# EAGLE design Akuaphonic_All_FIX (EAGLE 7.2.0)
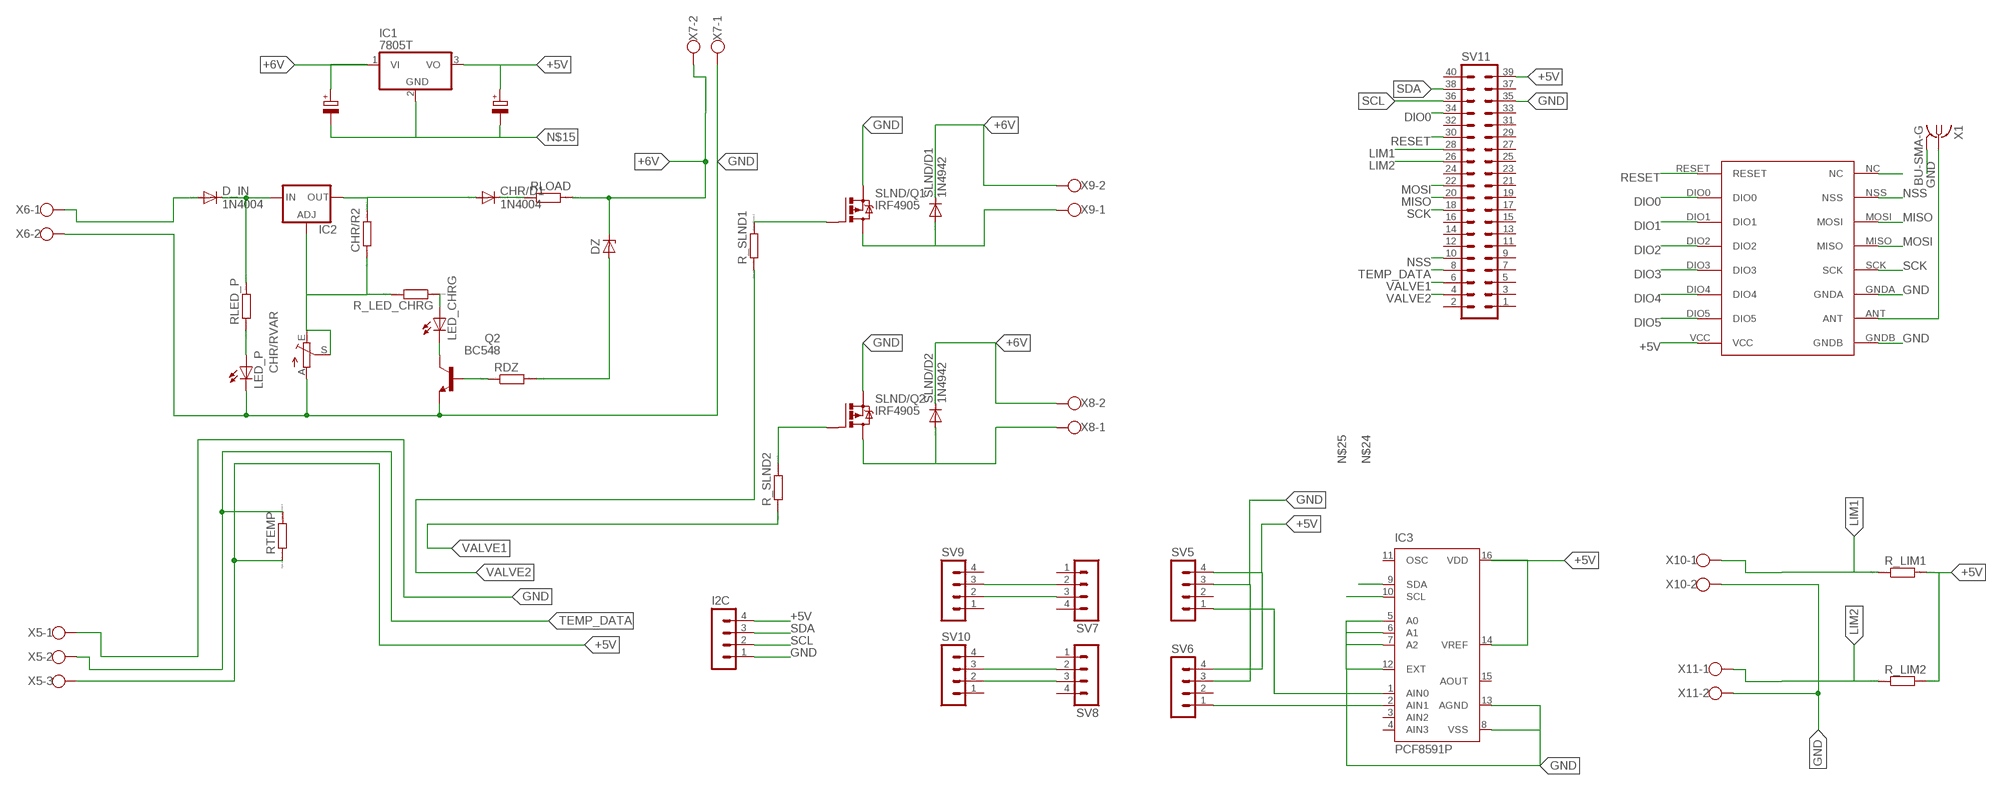
[diagram p0: schematic, sheet 1]

## Parts
CHR/D1  1N4004  [DO41-10]
CHR/R2  R0207/10  [0207/10]
CHR/RVAR  TRIM_EU-B25P  [B25P]
D_IN  1N4004  [DO41-10]
DZ  ZENER-DIODEDO35Z10  [DO35Z10]
I2C  MA04-1  [MA04-1]
IC1  7805T  [TO220H]
IC2  LM317TL  [317TL]
IC3  PCF8591P  [DIL16]
LED_CHRG  LED3MM  [LED3MM]
LED_P  LED3MM  [LED3MM]
Q2  BC548  [TO92-EBC]
R_LED_CHRG  R0207/10  [0207/10]
R_LIM1  R0207/10  [0207/10]
R_LIM2  R0207/10  [0207/10]
R_SLND1  R0207/10  [0207/10]
R_SLND2  R0207/10  [0207/10]
RDZ  R0207/10  [0207/10]
RLED_P  R0207/10  [0207/10]
RLOAD  R0207/10  [0207/10]
RTEMP  R0207/10  [0207/10]
SLND/D1  1N4942  [DO41-10]
SLND/D2  1N4942  [DO41-10]
SLND/Q1  IRF4905  [TO220BH]
SLND/Q2  IRF4905  [TO220BH]
SV5  MA04-1  [MA04-1]
SV6  MA04-1  [MA04-1]
SV7  MA04-1  [MA04-1]
SV8  MA04-1  [MA04-1]
SV9  MA04-1  [MA04-1]
SV10  MA04-1  [MA04-1]
SV11  MA20-2  [MA20-2]
U$1  RFM69HW  [RFM]
X1  BU-SMA-G  [BU-SMA-G]
X5  W237-103  [W237-103]
X6  W237-102  [W237-102]
X7  W237-102  [W237-102]
X8  W237-102  [W237-102]
X9  W237-102  [W237-102]
X10  W237-102  [W237-102]
X11  W237-102  [W237-102]

## Nets
+5V: I2C.4 IC1.3(VO) IC3.14(VREF) IC3.16(VDD) R_LIM1.2 R_LIM2.2 RTEMP.1 SV5.4 SV6.4 SV11.39 U$1.VCC X5.3
+6V: DZ.C IC1.1(VI) RLOAD.2 SLND/D1.C SLND/D2.C X7.2 X8.2 X9.2
DIO0: SV11.34 U$1.DIO0
DIO1: U$1.DIO1
DIO2: U$1.DIO2
DIO3: U$1.DIO3
DIO4: U$1.DIO4
DIO5: U$1.DIO5
DLOAD: CHR/D1.C RLOAD.1
GND: CHR/RVAR.A I2C.1 IC3.5(A0) IC3.6(A1) IC3.7(A2) IC3.8(VSS) IC3.12(EXT) IC3.13(AGND) LED_P.K(C) Q2.E SLND/Q1.S SLND/Q2.S SV5.3 SV6.3 SV11.35 U$1.GNDA U$1.GNDB X1.2 X1.3 X1.4 X1.5 X5.1 X6.2 X7.1 X10.2 X11.2
LIM1: R_LIM1.1 SV11.28 X10.1
LIM2: R_LIM2.1 SV11.26 X11.1
LM143: CHR/R2.1 CHR/RVAR.E CHR/RVAR.S IC2.1(ADJ) R_LED_CHRG.2
MISO: SV11.20 U$1.MOSI
MOSI: SV11.22 U$1.MISO
N$1: D_IN.A X6.1
N$2: LED_CHRG.K(C) Q2.C
N$3: U$1.ANT X1.1
N$4: D_IN.C IC2.3(IN) RLED_P.2
N$5: CHR/D1.A CHR/R2.2 IC2.2(OUT)
N$6: SLND/D1.A SLND/Q1.D X9.1
N$9: LED_P.A RLED_P.1
N$10: Q2.B RDZ.1
N$12: R_SLND1.2 SLND/Q1.G
N$13: LED_CHRG.A R_LED_CHRG.1
N$15: IC1.2(GND)
N$16: SLND/D2.A SLND/Q2.D X8.1
N$18: SV7.2 SV9.3
N$21: R_SLND2.2 SLND/Q2.G
N$22: SV7.3 SV9.2
N$23: DZ.A RDZ.2
N$24: IC3.9(SDA)
N$25: IC3.10(SCL)
N$27: U$1.NC
N$68: SV8.2 SV10.3
N$69: SV8.3 SV10.2
N$72: IC3.1(AIN0) SV5.1
N$73: IC3.2(AIN1) SV6.1
NSS: SV11.10 U$1.NSS
RESET: SV11.30 U$1.RESET
SCK: SV11.18 U$1.SCK
SCL: I2C.2 SV11.36
SDA: I2C.3 SV11.38
TEMP_DATA: RTEMP.2 SV11.8 X5.2
VALVE1: R_SLND2.1 SV11.6
VALVE2: R_SLND1.1 SV11.4
Unconnected: IC3.3(AIN2) IC3.4(AIN3) IC3.11(OSC) IC3.15(AOUT) SV5.2 SV6.2 SV7.1 SV7.4 SV8.1 SV8.4 SV9.1 SV9.4 SV10.1 SV10.4 SV11.1 SV11.2 SV11.3 SV11.5 SV11.7 SV11.9 SV11.11 SV11.12 SV11.13 SV11.14 SV11.15 SV11.16 SV11.17 SV11.19 SV11.21 SV11.23 SV11.24 SV11.25 SV11.27 SV11.29 SV11.31 SV11.32 SV11.33 SV11.37 SV11.40

## Library data of the parts
CHR/D1 D_IN = diode:1N4004: DIODE general purpose rectifier, 1 A
CHR/R2 R_LED_CHRG R_LIM1 R_LIM2 R_SLND1 R_SLND2 RDZ RLED_P RLOAD RTEMP = eagle-ltspice:R: RESISTOR, European symbol; SPICEMODEL: NONE; SPICEPREFIX: R
CHR/RVAR = pot:TRIM_EU-: POTENTIOMETER
DZ = diode:ZENER-DIODE: Z-Diode
I2C SV5-SV10 = con-lstb:MA04-1: PIN HEADER; OC_FARNELL: unknown; OC_NEWARK: unknown
IC1 = linear:78*: Positive VOLTAGE REGULATOR Source: http://cache.national.com/ds/LM/LM78L05.pdf http://www.fairchildsemi.com/ds/LM/LM7805.pdf
IC2 = v-reg:LM317TL: VOLTAGE REGULATOR
IC3 = micro-philips:PCF8591: I2C-Bus D/A CONVERTER; MF: FARNELL; MPN: PCF8591P; OC_FARNELL: 396412; OC_NEWARK: 07WX3385
LED_CHRG LED_P = led:LED: LED OSRAM: - CHIPLED LG R971, LG N971, LY N971, LG Q971, LY Q971, LO R971, LY R971 LH N974, LH R974 LS Q976, LO Q976, LY Q976 LO Q996 - Hyper CHIPLED LW Q18S LB Q993, LB Q99A, LB R99A - SideLED LS A670, LO A670, LY A670, LG A670, LP A670 LB A673, LV A673, LT A673, LW A673 LH A674 LY A675 LS A676, LA A676, LO A676, LY A676, LW A676 LS A679, LY A679, LG A679 - Hyper Micro SIDELED® LS Y876, LA Y876, LO Y876, LY Y876 LT Y87S - SmartLED LW L88C, LW L88S LB L89C, LB L89S, LG L890 LS L89K, LO L89K, LY L89K LS L896, LA L896, LO L896, LY L896 - TOPLED LS T670, LO T670, LY T670, LG T670, LP T670 LSG T670, LSP T670, LSY T670, LOP T670, LYG T670 LG T671, LOG T671, LSG T671 LB T673, LV T673, LT T673, LW T673 LH T674 LS T676, LA T676, LO T676, LY T676, LB T676, LH T676, LSB T676, LW T676 LB T67C, LV T67C, LT T67C, LS T67K, LO T67K, LY T67K, LW E67C LS E67B, LA E67B, LO E67B, LY E67B, LB E67C, LV E67C, LT E67C LW T67C LS T679, LY T679, LG T679 LS T770, LO T770, LY T770, LG T770, LP T770 LB T773, LV T773, LT T773, LW T773 LH T774 LS E675, LA E675, LY E675, LS T675 LS T776, LA T776, LO T776, LY T776, LB T776 LHGB T686 LT T68C, LB T68C - Hyper Mini TOPLED® LB M676 - Mini TOPLED Santana® LG M470 LS M47K, LO M47K, LY M47K Source: http://www.osram.convergy.de LUXEON: - LUMILED® LXK2-PW12-R00, LXK2-PW12-S00, LXK2-PW14-U00, LXK2-PW14-V00 LXK2-PM12-R00, LXK2-PM12-S00, LXK2-PM14-U00 LXK2-PE12-Q00, LXK2-PE12-R00, LXK2-PE12-S00, LXK2-PE14-T00, LXK2-PE14-U00 LXK2-PB12-K00, LXK2-PB12-L00, LXK2-PB12-M00, LXK2-PB14-N00, LXK2-PB14-P00, LXK2-PB14-Q00 LXK2-PR12-L00, LXK2-PR12-M00, LXK2-PR14-Q00, LXK2-PR14-R00 LXK2-PD12-Q00, LXK2-PD12-R00, LXK2-PD12-S00 LXK2-PH12-R00, LXK2-PH12-S00 LXK2-PL12-P00, LXK2-PL12-Q00, LXK2-PL12-R00 Source: www.luxeon.com KINGBRIGHT: KA-3528ASYC Source: www.kingbright.com
Q2 = transistor-npn:BC548*: NPN Transistor
SLND/D1 SLND/D2 = diode:1N4942: DIODE 1.0 A, 200 V, 150 ns
SLND/Q1 SLND/Q2 = transistor-power:IRF4905: P-Channel HEXFET® Power MOSFET RDS(on)= 0.02 Ohm, ID = -74A Source: http://www.irf.com/product-info/datasheets/data/irf4905pbf.pdf
SV11 = con-lstb:MA20-2: PIN HEADER; OC_FARNELL: unknown; OC_NEWARK: unknown
U$1 = hoperf:RFM69HW
X1 = con-coax:BU-SMA-G: FEMALE SMA CONNECTOR Radiall distributor RS 193-9117; OC_FARNELL: unknown; OC_NEWARK: unknown
X5 = con-wago-500:W237-103: WAGO SCREW CLAMP; MPN: 237-103; OC_FARNELL: unknown; OC_NEWARK: 18M7116
X6-X11 = con-wago-500:W237-102: WAGO SCREW CLAMP; MPN: 237-102; OC_FARNELL: unknown; OC_NEWARK: 70K9898

## Board
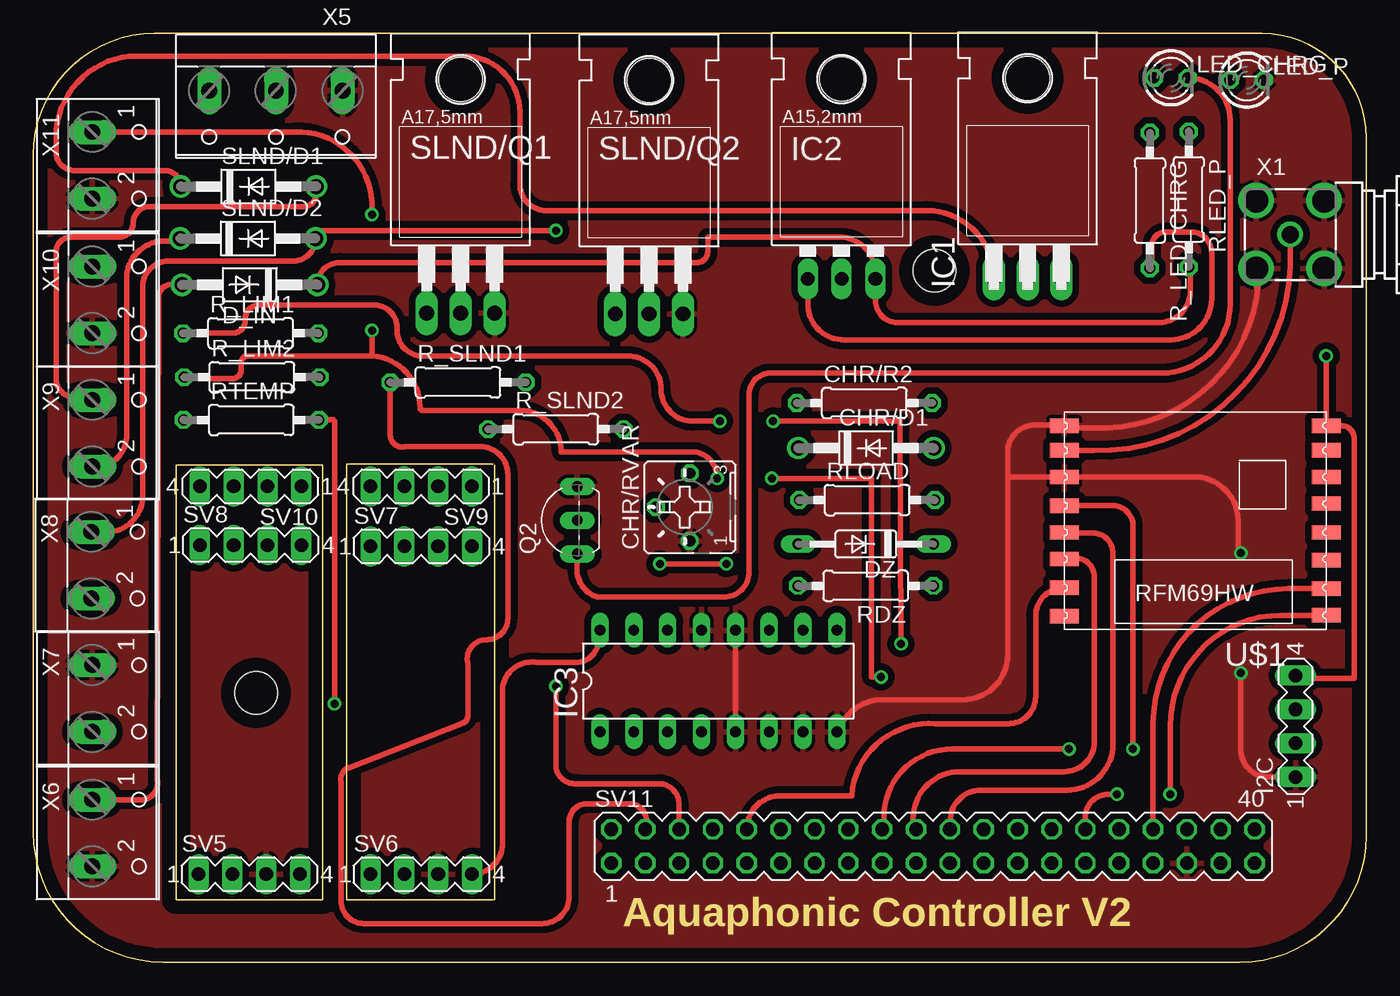
[diagram p1: board, top side]
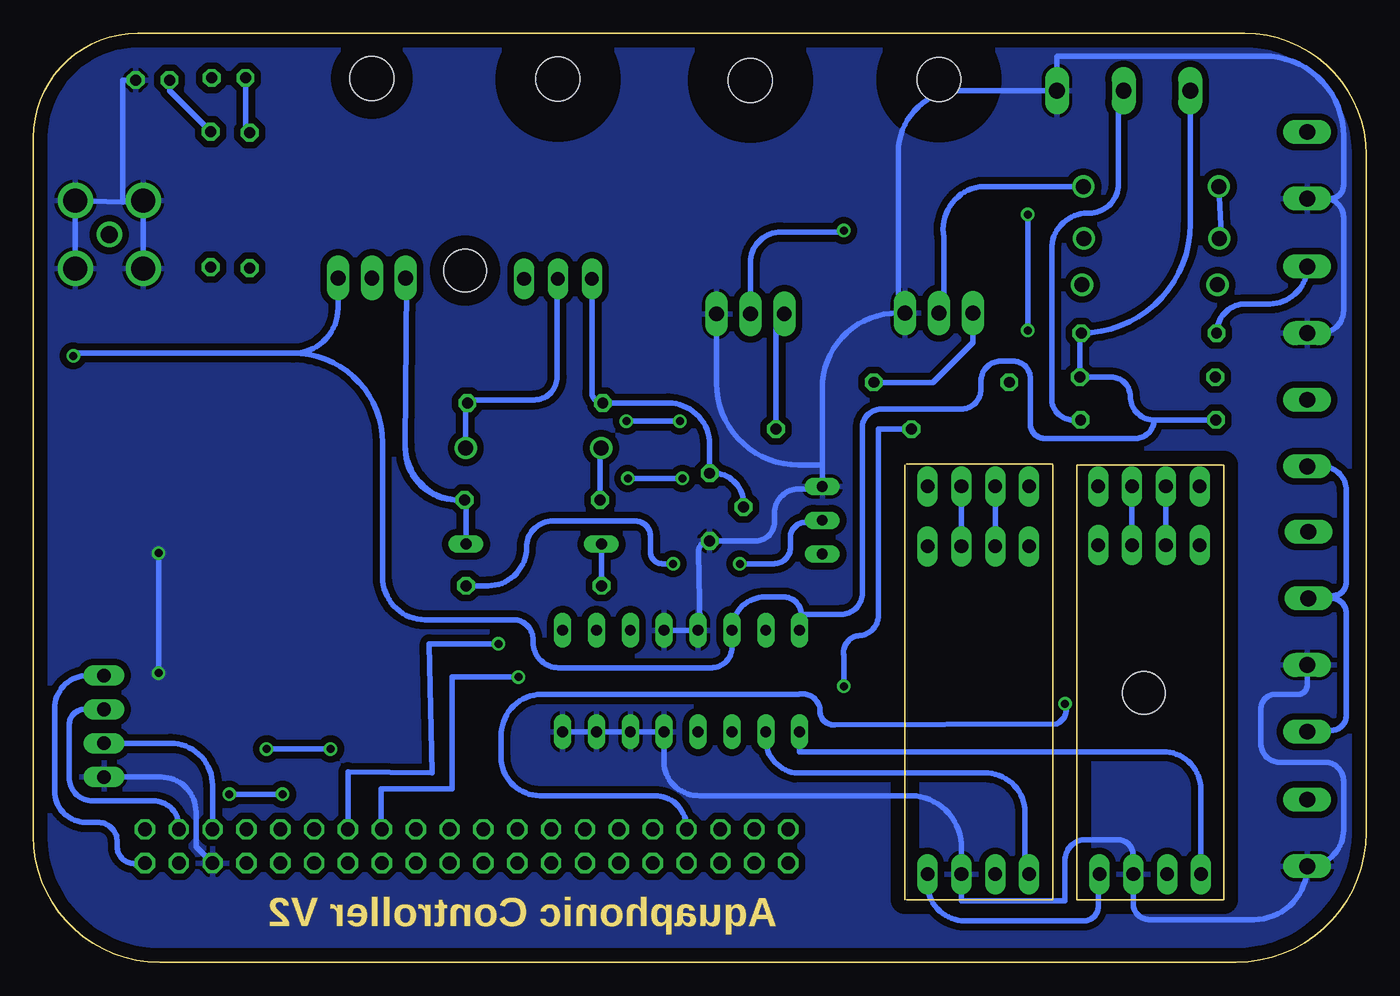
[diagram p2: board, bottom side, seen from below]

Size 100 x 69.7 mm. Coordinates in mm from the lower left corner, seen from the top.
Outline: 23.5,37.3 23.5,4.7 34.5,4.7
Outline: 34.6,4.7 34.6,37.3
Outline: 34.5,37.4 23.5,37.4
Outline: 10.7,4.7 21.7,4.7 21.7,37.3 10.7,37.3 10.7,4.7
Outline: 9.11,69.7 92.15,69.7 arc-90 100,61.85 100,9.46 arc-90 90.54,0 9.73,0 arc-90 0,9.73 0,60.59 arc-90 9.11,69.7
Copper layers (1*16): Top 0.035mm / dielectric 1.5mm / Bottom 0.035mm
Design rules "default": minimum track width 10mil, minimum drill 24mil, track to track 8mil, track to pad 8mil, pad to pad 8mil, via to via 8mil, smd to smd 8mil, copper to edge 40mil, drill to drill 8mil, minimum pad ring 10mil, minimum via ring 8mil, stop-mask expansion 4mil, vias tented up to drill 0mil, thermal gap 10mil
Holes 3.2 mm at 16.7,20.2 67.6,51.9

### Footprints (pad centres in the part's own frame; a part is rotated, then mirrored left to right if it is on the bottom)
DO41-10 = drill 1.118: A 5.08,0; C -5.08,0
0207/10 = drill 0.813 octagon: 1 -5.08,0; 2 5.08,0
B25P = drill 0.813 octagon: A -2.54,0; E 2.54,0; S 0,2.54
DO35Z10 = drill 0.813 long: A 5.08,0; C -5.08,0
MA04-1 = drill 1.016 long: 1 -3.81,0; 2 -1.27,0; 3 1.27,0; 4 3.81,0
TO220H = drill 1.118 long: 1 -2.54,-10.16; 2 0,-10.16; 3 2.54,-10.16 | hole 3.302: 0,4.826
317TL = drill 1.016 long: 1 -2.54,-3.81; 2 0,-3.81; 3 2.54,-3.81 | hole 3.302: 0,11.176
DIL16 = drill 0.813 long: 1 -8.89,-3.81; 2 -6.35,-3.81; 3 -3.81,-3.81; 4 -1.27,-3.81; 5 1.27,-3.81; 6 3.81,-3.81; 7 6.35,-3.81; 8 8.89,-3.81; 9 8.89,3.81; 10 6.35,3.81; 11 3.81,3.81; 12 1.27,3.81; 13 -1.27,3.81; 14 -3.81,3.81; 15 -6.35,3.81; 16 -8.89,3.81
LED3MM = drill 0.813 octagon: A -1.27,0; K 1.27,0
TO92-EBC = drill 0.813 long: B 0,-1.27; C -2.54,-1.27; E 2.54,-1.27
TO220BH = drill 1.118 long: D 0,-6.35; G -2.54,-6.35; S 2.54,-6.35 | hole 3.302: 0,11.176
MA20-2 = drill 1.016 octagon: 1 -24.13,-1.27; 2 -24.13,1.27; 3 -21.59,-1.27; 4 -21.59,1.27; 5 -19.05,-1.27; 6 -19.05,1.27; 7 -16.51,-1.27; 8 -16.51,1.27; 9 -13.97,-1.27; 10 -13.97,1.27; 11 -11.43,-1.27; 12 -11.43,1.27; 13 -8.89,-1.27; 14 -8.89,1.27; 15 -6.35,-1.27; 16 -6.35,1.27; 17 -3.81,-1.27; 18 -3.81,1.27; 19 -1.27,-1.27; 20 -1.27,1.27; 21 1.27,-1.27; 22 1.27,1.27; 23 3.81,-1.27; 24 3.81,1.27; 25 6.35,-1.27; 26 6.35,1.27; 27 8.89,-1.27; 28 8.89,1.27; 29 11.43,-1.27; 30 11.43,1.27; 31 13.97,-1.27; 32 13.97,1.27; 33 16.51,-1.27; 34 16.51,1.27; 35 19.05,-1.27; 36 19.05,1.27; 37 21.59,-1.27; 38 21.59,1.27; 39 24.13,-1.27; 40 24.13,1.27
RFM = smd 2.184 x 1.067: ANT 19.651,2.889; DIO0 0,13.27; DIO1 0,11.143; DIO2 0,9.047; DIO3 0,6.889; DIO4 0,4.889; DIO5 0,2.889; GNDA 19.651,4.889; GNDB 19.651,1.048; MISO 19.651,9.047; MOSI 19.651,11.047; NC 19.651,15.334; NSS 19.651,13.206; RESET 0,15.27; SCK 19.651,7.048; VCC 0,1.048
BU-SMA-G = drill 1.27: 1 0,0 | drill 1.778: 2 -2.55,2.55; 3 2.55,2.55; 4 2.55,-2.55; 5 -2.55,-2.55
W237-103 = drill 1.194 long: 1 -5,-1.29; 2 0,-1.29; 3 5,-1.29
W237-102 = drill 1.194 long: 1 -2.5,-1.27; 2 2.5,-1.27

### Placement (x,y rotation side)
CHR/D1  62.48,38.58 0 top
CHR/R2  62.35,41.96 0 top
CHR/RVAR  49.26,34.15 90 top
D_IN  16.24,50.83 180 top
DZ  62.46,31.37 180 top
I2C  94.7,17.7 90 top
IC1  74.6,61.5 0 top
IC2  60.64,55.09 0 top
IC3  51.4,21.1 0 top
LED_CHRG  85.35,66.36 0 top
LED_P  91.05,66.19 0 top
Q2  39.54,33.16 90 top
R_LED_CHRG  83.77,57.16 270 top
R_LIM1  16.3,47.2 0 top
R_LIM2  16.4,43.9 0 top
R_SLND1  31.86,43.51 0 top
R_SLND2  39.2,40 0 top
RDZ  62.45,28.24 180 top
RLED_P  86.69,57.24 270 top
RLOAD  62.56,34.68 0 top
RTEMP  16.35,40.69 0 top
SLND/D1  16.14,58.2 0 top
SLND/D2  16.1,54.3 0 top
SLND/Q1  32.06,55.06 0 top
SLND/Q2  46.2,55 0 top
SV5  16.2,6.6 0 top
SV6  29.1,6.6 0 top
SV7  29.1,31.2 0 top
SV8  16.3,31.3 0 top
SV9  29.1,35.7 180 top
SV10  16.3,35.7 180 top
SV11  67.5,8.7 0 top
U$1  97,41.3 180 top
X1  94.3,54.6 0 top
X5  18.2,64.1 180 top
X6  5.7,9.7 270 top
X7  5.7,19.8 270 top
X8  5.6,29.8 270 top
X9  5.7,39.7 270 top
X10  5.7,49.7 270 top
X11  5.7,59.8 270 top

### Tracks (layer width: path | path; a pad name or v marks a point on that pad's centre or on a via)
+5V  (via drill 0.6)
  Top 0.406: v97,45.5 U$1.VCC 98.15,40.25 arc-90 99.1,39.3 99.1,21.3 94.7,21.3 I2C.4 | v33,6.6 32.66,6.6 arc90 35.2,8.74 35.2,20.64 arc-90 37.76,22.5 40.7,22.5 arc90 42.41,24.21 IC3.16
  Bottom 0.406: v33,6.6 SV6.4 32.91,5.91 arc-90 30.1,3.1 21.2,3.1 arc-90 20.1,4.2 20.1,6.51 arc90 SV5.4 | I2C.4 95.92,21.51 arc-90 98.4,19.03 98.4,12.84 arc-90 96.06,10.5 95.18,10.5 arc90 93.7,9.02 93.7,8.67 arc-90 92.43,7.4 91.63,7.4 SV11.39 | RTEMP.1 15.92,40.69 | 15.92,40.69 arc90 17.7,42.47 arc-90 19.13,43.9 R_LIM2.2 21.48,47.1 arc90 R_LIM1.2 arc-90 13.2,55.38 X5.3 | IC1.3 77.14,49.07 arc90 80.52,45.7 | 80.52,45.7 97,45.7 v97,45.5 | 42.4,26.1 arc-90 43.7,27.4 45.1,27.4 arc-90 IC3.14 47.59,23.61 arc90 49.1,22.1 60.6,22.1 arc90 62.5,24 62.5,24.2 arc-90 64,25.7 70.6,25.7 arc90 73.8,28.9 73.8,38.98 arc-90 80.52,45.7 | 42.4,26.1 42.4,25.02 arc90 IC3.16 | 42.4,26.1 39.4,26.1 arc-90 37.8,27.7 37.8,40.1 arc90 36.4,41.5 30.4,41.5 arc-90 28.9,43 28.9,43.6 arc90 27.4,45.1 26.5,45.1 arc90 25.2,43.8 25.2,40.4 arc-90 24.1,39.3 17.31,39.3 arc-90 15.92,40.69
+6V
  Top 0.406: X9.2 4.8,37.2 arc90 7,39.6 7,51.4 arc-90 9.9,54.1 10.82,54.1 arc90 SLND/D2.C | SLND/D1.C arc90 9.86,59.4 3.1,59.4 arc-90 1.7,60.8 1.7,61.9 arc-90 7.8,68 32.3,68 arc-90 36.5,63.8 36.5,58.4 arc90 38.5,56.4 67,56.4 arc-90 IC1.1
  Bottom 0.406: DZ.C 67.54,34.68 RLOAD.2 | RLOAD.2 67.64,34.7 68.27,34.7 arc90 72.1,38.53 72.1,38.8 | 72,50.84 IC1.1 | SLND/D1.C 10.86,54.56 arc90 SLND/D2.C | X9.2 3.3,37.2 arc90 1.5,35.4 1.5,28.5 arc90 2.5,27.5 4.13,27.5 arc-90 X8.2 2.6,27.3 arc90 1.5,26.2 1.5,18.5 arc90 2.6,17.4 4.33,17.4 arc-90 X7.2 | RLOAD.2 67.98,34.68 arc90 72.1,38.8 | 72.1,38.8 72,50.84 | 72,50.84 72,51.4
DIO0
  Top 0.406: U$1.DIO0 94.17,28.03 arc90 84.01,17.87 SV11.34
DLOAD
  Bottom 0.406: RLOAD.1 57.48,38.58 CHR/D1.C
GND  (via drill 0.6)
  Top 0.406: X1.5 91.8,50.55 91.9,51.01 arc-90 79.39,40.1 77.35,40.1 U$1.GNDB 77.35,40.3 75.12,40.3 arc90 73.1,38.27 73.1,36.41 | 73.1,36.41 73.1,23.04 arc-90 69.76,19.7 63.68,19.7 arc90 60.29,16.31 IC3.8 | v90.6,30.7 90.4,30.9 90.4,33.09 arc90 87.08,36.41 U$1.GNDA 73.1,36.41 | v90.6,21.7 90.6,15.95 arc90 92.66,13.89 I2C.1 | IC3.5 IC3.12
  Bottom 0.406: X1.4 X1.3 93.3,57.05 | 93.3,57.05 X1.2 X1.5 | LED_P.K 93.3,66.19 93.3,57.05 | I2C.1 90.41,13.89 arc90 87.8,11.28 87.8,8.78 arc-45 87.73,8.61 SV11.35 | IC3.8 IC3.7 IC3.6 IC3.5 52.7,15.89 52.7,15.02 arc-90 49.98,12.5 34.16,12.5 arc90 30.37,8.52 SV6.3 30.37,4.6 22.6,4.6 22.6,7.64 arc90 21.04,9.2 18.64,9.2 arc90 17.5,8.06 17.5,6.6 SV5.3 17.47,4.37 arc-90 16.3,3.2 8.43,3.2 arc-90 X6.2 arc-90 1.7,9.93 1.7,13.6 arc-90 3.1,15 6.5,15 arc90 7.9,16.4 7.9,19 arc90 6.8,20.1 5.1,20.1 arc-90 4.43,20.77 X7.1 | IC3.12 IC3.13 50,25.31 50.1,30.76 arc90 CHR/RVAR.A 45.78,31.61 arc-90 44.4,32.99 44.4,33.7 arc90 42.6,35.5 40.81,35.5 Q2.E 40.81,37.3 | v90.6,30.7 v90.6,21.7 | SLND/Q1.S 35.15,48.71 | 35.15,48.71 arc-90 40.81,43.05 40.81,37.3 | 35.15,48.71 arc-90 35.1,48.76 35.1,60.8 arc90 30.51,65.39 X5.1 23.2,67.9 arc90 23.1,68 7.7,68 arc90 1.7,62 1.7,58.3 arc90 2.7,57.3 | X11.2 3.1,57.3 arc90 1.7,55.9 1.7,48.9 arc90 3.4,47.2 X10.2 | X10.2 4.7,47.2 arc-90 4.9,47 4.63,47 arc-90 X10.2 | SLND/Q2.S 48.74,43.44 arc-90 42.6,37.3 40.81,37.3
  pour Bottom (isolate 0.5): 0.1,10.7 0,10.7 0,60.46 arc-90 9.14,69.6 94.51,69.6 arc-90 99.9,64.21 99.9,9.32 arc-90 90.48,-0.1 9.53,-0.1 arc-90 0.1,9.33
  pour Top (isolate 0.5): 0.1,9.2 0.1,60.57 arc-90 9.13,69.6 94.79,69.6 arc-90 100.1,64.29 100.1,9.16 arc-90 91.04,0.1 9.2,0.1 arc-90
LIM1  (via drill 0.6)
  Top 0.406: v65.1,23.9 65,40.6 v55.5,40.6 | v51.5,40.6 49.48,40.6 arc-90 47.1,42.98 arc90 44.58,45.5 29.17,45.5 arc-90 27.3,47.37 27.3,47.59 arc90 25.59,49.3 16.9,49.3 arc90 15.9,48.3 15.9,48.15 arc-90 14.95,47.2 R_LIM1.1
  Bottom 0.406: SV11.28 76.4,14.3 70.1,14.2 70.3,23.9 v65.1,23.9 | v55.5,40.6 v51.5,40.6 | X10.1 arc90 7.23,49.4 9.02,49.4 arc-90 R_LIM1.1
LIM2  (via drill 0.6)
  Top 0.406: v63.6,21.4 62.9,21.4 62.9,36.3 55.6,36.3 | 55.6,36.3 55.6,36.4 | v55.4,36.3 55.6,36.3 | v51.3,36.3 51.3,36.38 arc90 49.38,38.3 39.6,38.3 arc90 36.5,41.4 29.24,41.4 arc-90 29,41.64 arc90 25.14,45.5 | 25.14,45.5 16.1,45.5 arc90 15.6,45 15.6,44.43 arc-90 14.97,43.8 11.32,43.8 R_LIM2.1 | X11.1 19.6,62.3 arc-90 25.4,57 v25.4,56.1 | v25.4,47.4 25.4,45.5 25.14,45.5
  Bottom 0.406: SV11.26 73.9,9.97 73.9,13 68.6,13 68.6,21.4 v63.6,21.4 | v55.4,36.3 v51.3,36.3 | v25.4,56.1 v25.4,47.4
LM143
  Top 0.406: R_LED_CHRG.2 83.9,52.08 83.9,53.72 arc-90 84.98,54.8 86.84,54.8 arc-90 88.4,53.24 88.4,49.75 arc-90 85.35,46.7 60.83,46.7 arc-90 58.1,49.43 IC2.1
  Bottom 0.406: IC2.1 58.1,42.79 arc-90 CHR/R2.1 52.37,41.96 arc90 49.26,38.85 CHR/RVAR.E 48.97,36.69 arc90 46.72,34.44 CHR/RVAR.S
MISO
  Top 0.406: SV11.20 66,9.97 66,10.76 arc-90 69.54,14.3 77.36,14.3 arc90 79.6,16.54 79.6,28.94 arc90 78.24,30.3 77.35,30.3 U$1.MOSI
MOSI
  Top 0.406: SV11.22 68.8,9.97 68.8,10.64 arc-90 71.06,12.9 77.53,12.9 arc90 81,16.37 81,30.69 arc90 79.49,32.2 77.35,32.2 U$1.MISO
N$1
  Top 0.406: D_IN.A 10.63,50.83 arc90 9.4,50.1 9.3,13.7 arc-90 8.3,12.2 X6.1
N$2
  Top 0.406: Q2.C 40.9,30.62 40.9,30.21 arc90 42.31,27.4 51.8,27.4 arc90 53.7,29.3 53.7,42.58 arc-90 55.32,44.2 84.61,44.2 arc90 89.8,49.39 89.8,63.18 arc90 LED_CHRG.K
N$3
  Top 0.406: X1.1 94.3,52.19 arc-90 79.52,38.41 U$1.ANT
N$4
  Top 0.406: D_IN.C 21.3,50.83 arc-90 22.97,52.5 49.79,52.5 arc90 50.6,53.31 50.6,54.4 60.51,54.4 arc-90 63.18,51.73 IC2.3 63.18,49.65 arc90 64.83,48 84.46,48 arc90 86.8,50.34 86.8,52.16 RLED_P.2
N$5
  Bottom 0.406: CHR/D1.A 67.56,41.96 CHR/R2.2 67.43,42.2 62.41,42.2 arc-90 60.7,43.91 60.7,51.28 IC2.2
N$6
  Top 0.406: SLND/D1.A 21.22,57.62 arc-90 20.3,56.7 8.7,56.7 arc90 7.5,55.5 arc-90 6.4,54.4 2.8,54.4 arc90 1.7,53.3 1.7,43.8 arc90 3.1,42.4 4.23,42.4 arc-90 X9.1
  Bottom 0.406: SLND/D1.A 29,58.2 arc-90 31.7,54.4 31.7,49.07 arc90 SLND/Q1.D
N$9
  Bottom 0.406: LED_P.A 89.78,65.41 RLED_P.1
N$10  (via drill 0.6)
  Top 0.406: v52,29.9 v47,29.9
  Bottom 0.406: RDZ.1 65.89,28.24 arc-90 63,31.13 arc90 61.03,33.1 54.84,33.1 arc90 53.7,31.96 53.7,30.79 arc-90 52.81,29.9 v52,29.9 | v47,29.9 44.42,29.9 arc-90 43.2,31.12 43.2,31.88 arc90 42.08,33 40.81,33 Q2.B
N$12
  Bottom 0.406: SLND/Q1.G 29.52,46.48 32.5,43.5 35.83,43.5 R_SLND1.2
N$13
  Bottom 0.406: LED_CHRG.A 84.08,62.55 R_LED_CHRG.1
N$16  (via drill 0.6)
  Top 0.406: v39.2,54.9 21.78,54.9 arc90 SLND/D2.A arc-90 19.48,52.6 10.5,52.6 arc90 8.2,50.9 8.2,35.3 arc-90 5.8,32.3 X8.1
  Bottom 0.406: SLND/Q2.D 46.2,52.5 arc90 43.9,54.8 39.3,54.8 arc-90 v39.2,54.9
N$18
  Bottom 0.406: SV9.3 SV7.2
N$21
  Bottom 0.406: SLND/Q2.G 44.28,48.65 R_SLND2.2
N$22
  Bottom 0.406: SV9.2 SV7.3
N$23
  Bottom 0.406: RDZ.2 DZ.A
N$68
  Bottom 0.406: SV8.2 SV10.3
N$69
  Bottom 0.406: SV10.2 SV8.3
N$72
  Bottom 0.406: SV5.1 12.4,12.94 arc-90 15.26,15.8 42.51,15.8 IC3.1
N$73
  Bottom 0.406: SV6.1 25.6,6.6 25.6,10.94 arc-90 28.36,14.2 42.86,14.2 arc90 IC3.2
NSS
  Top 0.406: U$1.NSS arc90 75.2,25.95 75.2,19.93 arc-90 73.17,17.9 67.7,17.9 arc90 61.4,12.5 56.06,12.5 arc90 SV11.10
RESET  (via drill 0.6)
  Top 0.406: U$1.RESET 93.6,26.03 arc90 85.3,17.73 v85.3,12.6 | v81.3,12.6 80.61,12.6 arc90 78.93,10.92 SV11.30
  Bottom 0.406: v85.3,12.6 v81.3,12.6
SCK  (via drill 0.6)
  Top 0.406: U$1.SCK 81.14,34.25 arc-90 82.5,32.59 v82.5,16 | SV11.18 63.8,9.97 63.8,10.86 arc-90 68.94,16 v77.7,16
  Bottom 0.406: v82.5,16 v77.7,16
SCL
  Bottom 0.406: I2C.2 89.72,16.43 arc90 86.55,13.26 SV11.36
SDA
  Bottom 0.406: I2C.3 96.16,18.97 arc-90 97.3,17.83 97.3,13.85 arc-90 95.55,12.1 90.98,12.1 arc90 89.09,10.21 SV11.38
TEMP_DATA  (via drill 0.6)
  Top 0.406: v22.6,19.4 22.6,40.6 arc90 22.21,40.69 RTEMP.2
  Bottom 0.406: RTEMP.2 21.99,40.69 arc90 23.6,42.3 23.6,53.5 arc90 20.9,56.2 20.8,56.2 arc-90 18.6,58.4 18.6,64.99 arc90 X5.2 | SV11.8 50.99,10.09 arc-90 53.4,12.5 62,12.5 arc90 64.9,15.4 64.9,17.2 arc90 61.6,20.1 42.6,20.1 arc90 41,19.1 41,18.9 arc-90 39.9,17.8 23.2,17.9 arc-90 v22.6,19.4
VALVE1  (via drill 0.6)
  Top 0.406: v39.2,20.7 39.2,14.66 arc90 40.86,13.4 46.91,13.4 arc-90 48.45,11.86 SV11.6
  Bottom 0.406: R_SLND2.1 36.6,40 36.6,26.01 arc90 38.11,24.5 arc-90 39.2,23.01 v39.2,20.7
VALVE2
  Top 0.406: SV11.4 46,9.97 46,10.6 arc90 44.7,11.9 41.56,11.9 arc90 40.2,10.54 40.2,4.92 arc-90 38.18,2.9 24.78,2.9 arc-90 23.1,4.58 23.1,13.5 arc-90 23.7,14.6 32.1,17.9 arc90 32.6,18.7 32.6,22.4 arc-104 34,24.2 arc90 35.6,25.8 35.6,36.6 arc90 33.5,38.7 28,38.7 arc-109 26.78,39.56 R_SLND1.1

### Text on the board
Dimension: Aquaphonic Controller V2